# Altium project GPSDO.PrjPCB (part 1 of 4)
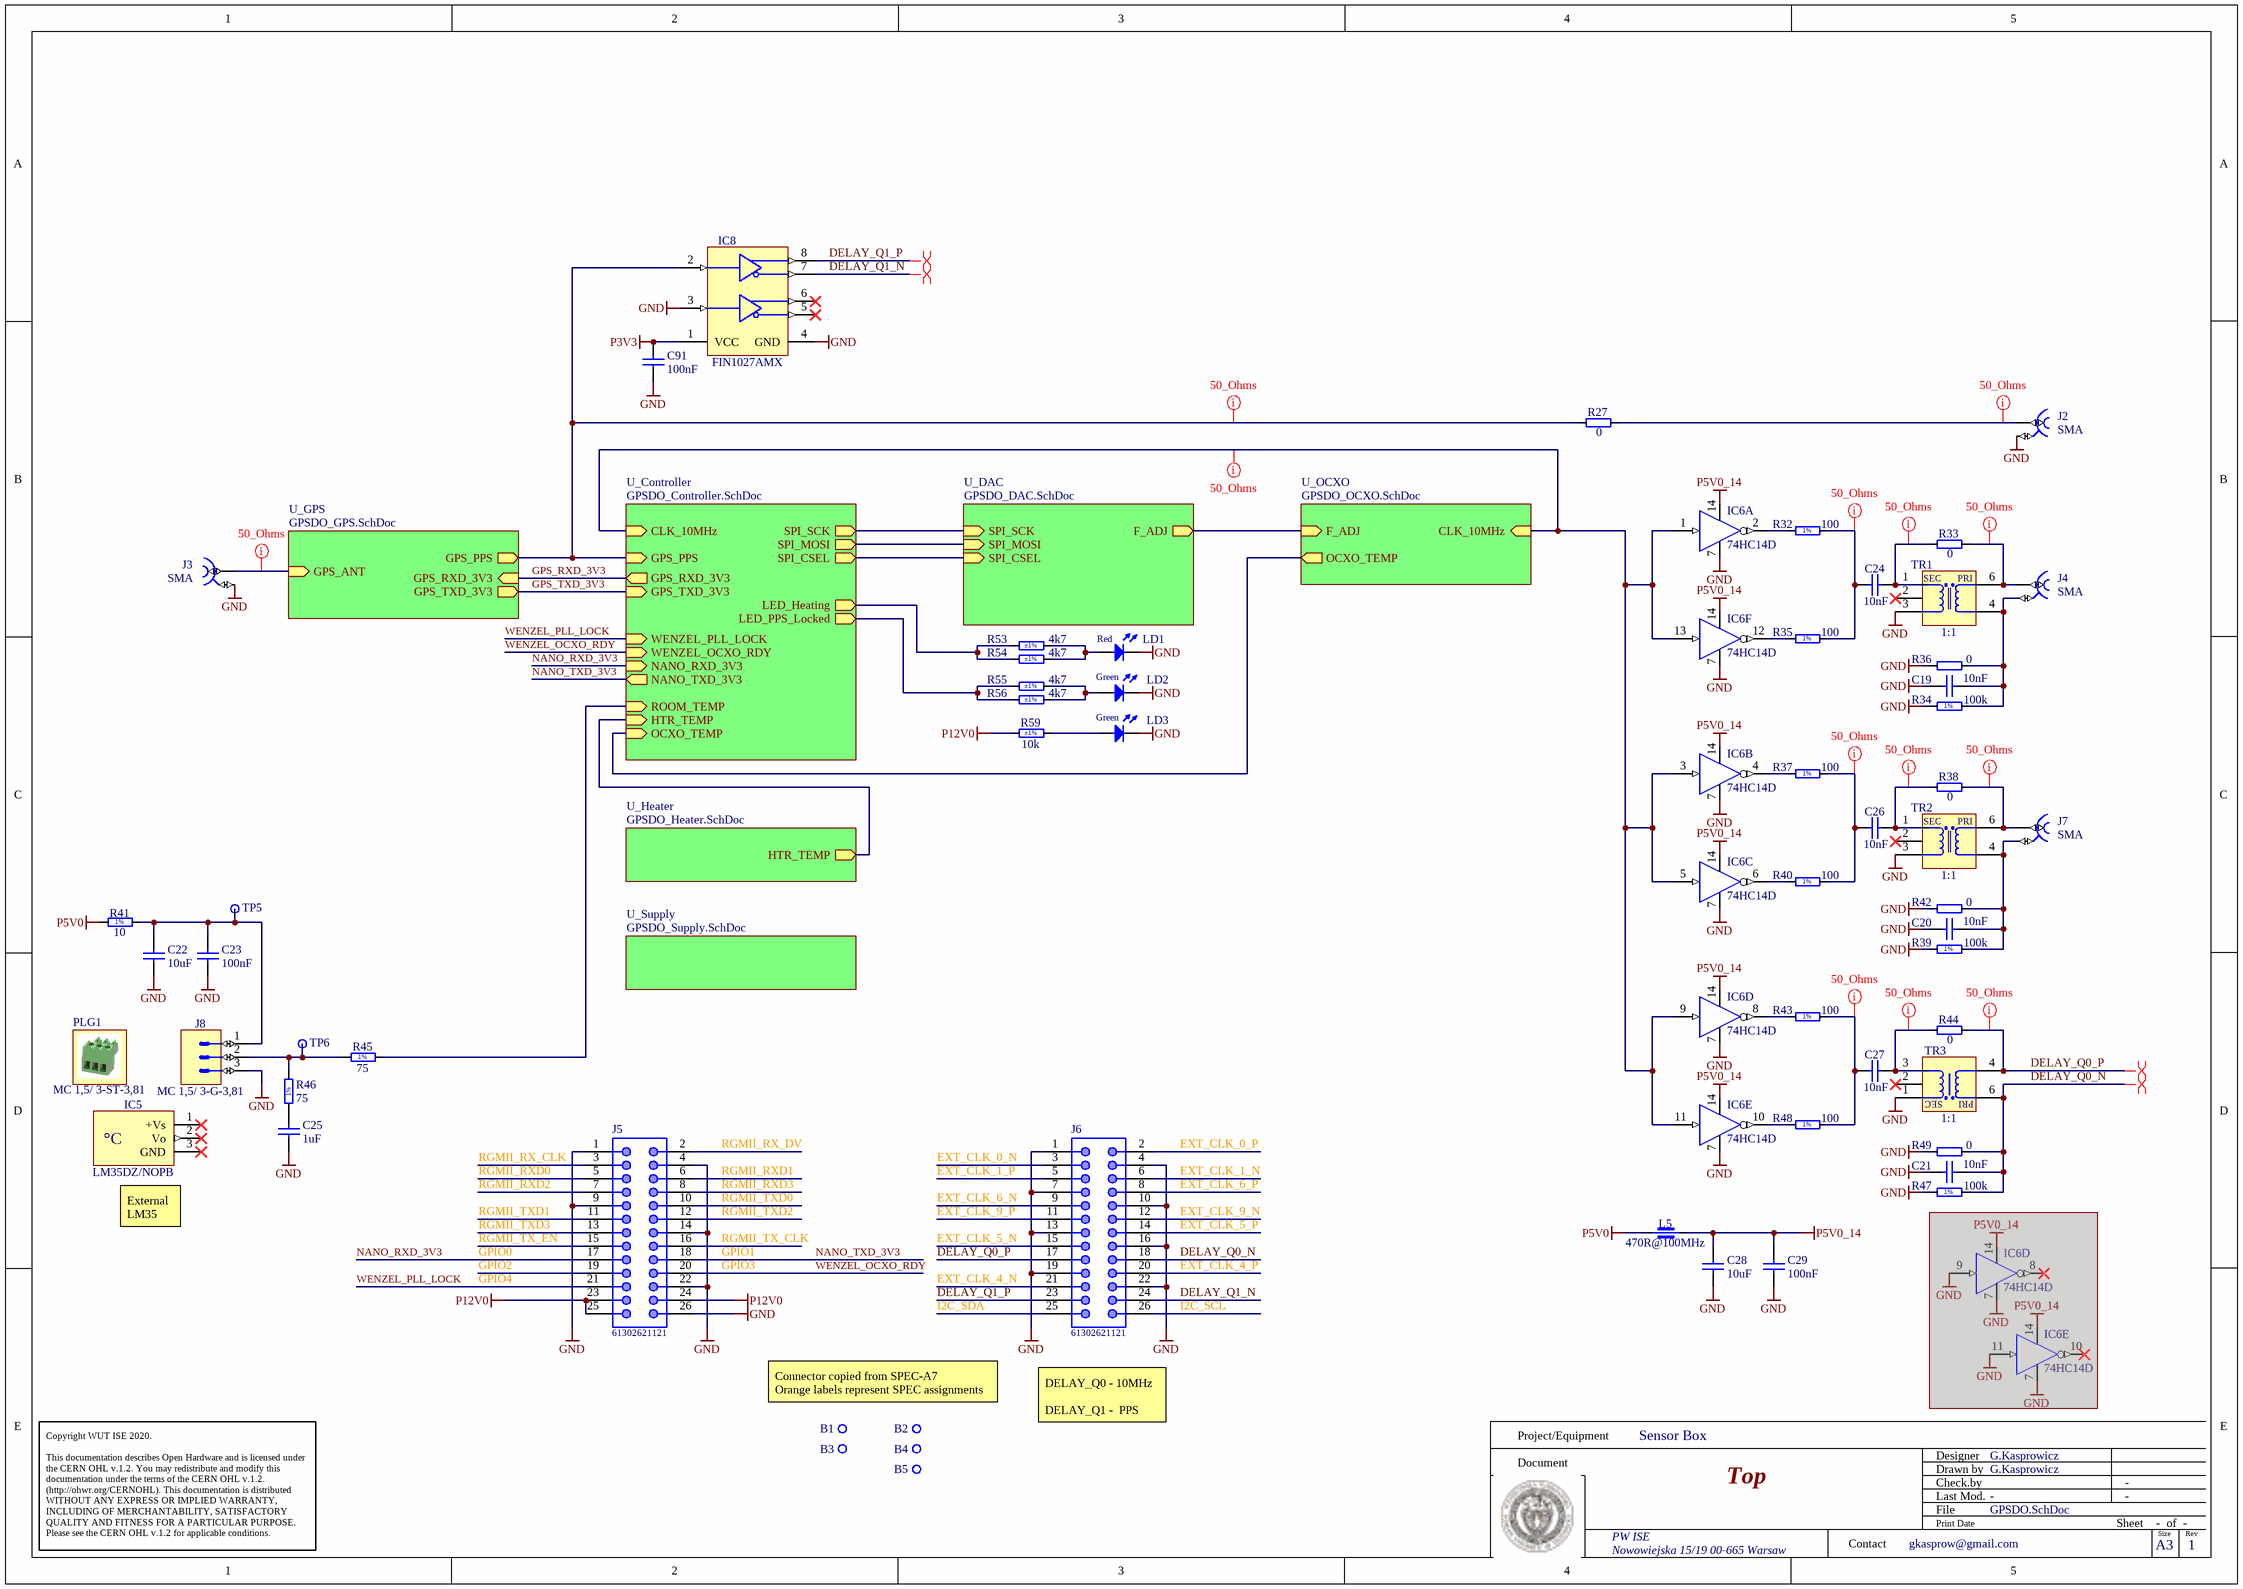
[diagram p0: GPSDO.SchDoc]
8 sheets, 359 parts. Net scope: hierarchical (ports join the sheet entries above them; power ports are global).
Board file: GSPDO.PcbDoc
Sheets:
  GPSDO.SchDoc
    U_Heater = GPSDO_Heater.SchDoc
    U_Controller = GPSDO_Controller.SchDoc
      Arduino = GPSDO_Arduino.SchDoc
    U_Supply = GPSDO_Supply.SchDoc
    U_GPS = GPSDO_GPS.SchDoc
    U_DAC = GPSDO_DAC.SchDoc
    U_OCXO = GPSDO_OCXO.SchDoc

## Sheet GPSDO.SchDoc: Top
size 420 x 297 mm; EDA_Number: ARTIQ; Projet: GPSDO; Author: G.Kasprowicz; CompanyName: WUT ISE; DrawnBy: G.Kasprowicz; Organization: WUT ISE; Address1: PW ISE; Address2: Nowowiejska 15/19 00-665 Warsaw; Address3: gkasprow@gmail.com; Revision: 1; SheetNumber: -; SheetTotal: -; ModifiedBy: -; CheckedDate: -; DivGrp: WUT ISE; Designer: G.Kasprowicz; ModifiedDate: -; ProjectName: Sensor Box

### Parts
(Parts that share a designator on the sheet are numbered #1, #2 ... from top to bottom, then left to right.)
B1  Plated Hole  [MTG270_500]  (value not drawn)  (no BOM)
B2  Non Plated Hole  [MTG400]  (value not drawn)  (no BOM)
B3  Plated Hole  [MTG270_500]  (value not drawn)  (no BOM)
B4  Non Plated Hole  [MTG400]  (value not drawn)  (no BOM)
B5  Non Plated Hole  [MTG400]  (value not drawn)  (no BOM)
C19  10nF  [CAPC1005X55N]
C20  10nF  [CAPC1005X55N]
C21  10nF  [CAPC1005X55N]
C22  10uF  [CAPC1608X80N]
C23  100nF  [CAPC1005X55N]
C24  10nF  [CAPC1005X55N]
C25  1uF  [CAPC1005X55N]
C26  10nF  [CAPC1005X55N]
C27  10nF  [CAPC1005X55N]
C28  10uF  [CAPC1608X80N]
C29  100nF  [CAPC1005X55N]
C91  100nF  [CAPC1005X55N]
IC5  LM35DZ/NOPB  [TO-92AA-P254]  (mechanical)
IC6#1  74HC14D  [SOIC127P600X175-14N]  (parts A,B,C,D,E,F of 6)
IC6#2  74HC14D  [SOIC127P600X175-14N]  (parts D,E of 6)  (masked out: inside a compile mask, not in the netlist)
IC8  FIN1027AMX  [SOIC127P600X175-8N]
J2  SMA  [DELOCK_65848]
J3  SMA  [DELOCK_65848]
J4  SMA  [DELOCK_65848]
J5  61302621121  [61302621121]
J6  61302621121  [61302621121]
J7  SMA  [DELOCK_65848]
J8  MC 1,5/ 3-G-3,81  [PHOENIX_1803280]
L5  470R@100MHz  [INDC1608X95N]
LD1  Red  [LED_AVAGO_HSMC-C120]
LD2  Green  [LED_AVAGO_HSME-C120]
LD3  Green  [LED_AVAGO_HSME-C120]
PLG1  MC 1,5/ 3-ST-3,81  [PHOENIX_1803581]
R27  0  [RESC1005X40N]
R32  100  [RESC1005X40N]
R33  0  [RESC1005X40N]
R34  100k  [RESC1005X40N]
R35  100  [RESC1005X40N]
R36  0  [RESC1608X55N]
R37  100  [RESC1005X40N]
R38  0  [RESC1005X40N]
R39  100k  [RESC1005X40N]
R40  100  [RESC1005X40N]
R41  10  [RESC1005X40N]
R42  0  [RESC1608X55N]
R43  100  [RESC1005X40N]
R44  0  [RESC1005X40N]
R45  75  [RESC1005X40N]
R46  75  [RESC1005X40N]
R47  100k  [RESC1005X40N]
R48  100  [RESC1005X40N]
R49  0  [RESC1608X55N]
R53  4k7  Tolerance: ±1%  [RESC1005X40N]
R54  4k7  Tolerance: ±1%  [RESC1005X40N]
R55  4k7  Tolerance: ±1%  [RESC1005X40N]
R56  4k7  Tolerance: ±1%  [RESC1005X40N]
R59  10k  Tolerance: ±1%  [RESC1005X40N]
TP5  Test Point  [TPS127]  (value not drawn)  (no BOM)
TP6  Test Point  [TPS127]  (value not drawn)  (no BOM)
TR1  1:1  [XFMR_MINI-CIRCUITS_AT224-1]
TR2  1:1  [XFMR_MINI-CIRCUITS_AT224-1]
TR3  1:1  [XFMR_MINI-CIRCUITS_AT224-1]

### Sub-sheets
U_Controller = GPSDO_Controller.SchDoc: GPS_RXD_3V3 (out), GPS_TXD_3V3 (in), GPS_PPS (in), ROOM_TEMP (in), CLK_10MHz (in), OCXO_TEMP (in), HTR_TEMP (in), SPI_SCK (out), SPI_MOSI (out), SPI_CSEL (out), NANO_RXD_3V3 (in), NANO_TXD_3V3 (out), LED_Heating (out), LED_PPS_Locked (out), WENZEL_PLL_LOCK (in), WENZEL_OCXO_RDY (in)
U_DAC = GPSDO_DAC.SchDoc: F_ADJ (out), SPI_SCK (in), SPI_MOSI (in), SPI_CSEL (in)
U_GPS = GPSDO_GPS.SchDoc: GPS_RXD_3V3 (in), GPS_TXD_3V3 (out), GPS_PPS (out), GPS_ANT (in)
U_Heater = GPSDO_Heater.SchDoc: HTR_TEMP (out)
U_OCXO = GPSDO_OCXO.SchDoc: CLK_10MHz (in), OCXO_TEMP (out), F_ADJ (in)
U_Supply = GPSDO_Supply.SchDoc: no entries

### Nets
GND: C19.1 C20.1 C21.1 C22.1 C23.1 C25.1 C28.1 C29.1 C91.1 IC6#1.7(GND) IC8.3(DIN2RIN-) IC8.4(GND) J2.2 J3.2 J5.1 J5.4 J5.9 J5.14 J5.22 J5.26 J6.1 J6.4 J6.7 J6.10 J6.13 J6.16 J6.19 J6.22 J8.3 LD1.1(C) LD2.1(C) LD3.1(C) R34.2 R36.1 R39.2 R42.1 R47.2 R49.1 TR1.3(S) TR2.3(S) TR3.1(SDOT)
P3V3: C91.2 IC8.1(VCC)
P5V0: L5.1 R41.1
P5V0_14: C28.2 C29.2 IC6#1.14(VCC) L5.2
P12V0: J5.23 J5.24 J5.25 R59.1
10MHz: IC6#1.1(IN) IC6#1.3(IN) IC6#1.5(IN) IC6#1.9(IN) IC6#1.11(IN) IC6#1.13(IN) ; sheet U_Controller/CLK_10MHz, sheet U_OCXO/CLK_10MHz
A1: sheet U_Heater/HTR_TEMP, sheet U_Controller/HTR_TEMP
A2: sheet U_Controller/OCXO_TEMP, sheet U_OCXO/OCXO_TEMP
A3: R45.2 ; sheet U_Controller/ROOM_TEMP
D2: R53.1 R54.1 ; sheet U_Controller/LED_Heating
D7: sheet U_Controller/SPI_SCK, sheet U_DAC/SPI_SCK
D9: sheet U_Controller/SPI_MOSI, sheet U_DAC/SPI_MOSI
D11: sheet U_Controller/SPI_CSEL, sheet U_DAC/SPI_CSEL
D13: R55.1 R56.1 ; sheet U_Controller/LED_PPS_Locked
DELAY_Q0_N: C21.2 J6.18 R47.1 R49.2 TR3.6(PDOT)
DELAY_Q0_P: J6.17 R44.1 TR3.4(P)
DELAY_Q1_N: IC8.7(DOUT-) J6.24
DELAY_Q1_P: IC8.8(DOUT+) J6.23
F_ADJ: sheet U_DAC/F_ADJ, sheet U_OCXO/F_ADJ
GPS_ANT: J3.1 ; sheet U_GPS/GPS_ANT
GPS_RXD_3V3: sheet U_Controller/GPS_RXD_3V3, sheet U_GPS/GPS_RXD_3V3
GPS_TXD_3V3: sheet U_Controller/GPS_TXD_3V3, sheet U_GPS/GPS_TXD_3V3
NANO_RXD_3V3: J5.17 ; sheet U_Controller/NANO_RXD_3V3
NANO_TXD_3V3: J5.18 ; sheet U_Controller/NANO_TXD_3V3
PPS: IC8.2(DIN1) R27.2 ; sheet U_Controller/GPS_PPS, sheet U_GPS/GPS_PPS
WENZEL_OCXO_RDY: J5.20 ; sheet U_Controller/WENZEL_OCXO_RDY  [project net D14]
WENZEL_PLL_LOCK: J5.21 ; sheet U_Controller/WENZEL_PLL_LOCK  [project net D15]
NetC19_2: C19.2 J4.2 R34.1 R36.2 TR1.4(P)
NetC20_2: C20.2 J7.2 R39.1 R42.2 TR2.4(P)
NetC22_2: C22.2 C23.2 J8.1 R41.2 TP5.1
NetC24_1: C24.1 R32.2 R35.2
NetC24_2: C24.2 R33.2 TR1.1(SDOT)
NetC25_2: C25.2 R46.1
NetC26_1: C26.1 R37.2 R40.2
NetC26_2: C26.2 R38.2 TR2.1(SDOT)
NetC27_1: C27.1 R43.2 R48.2
NetC27_2: C27.2 R44.2 TR3.3(S)
NetIC6#1_2: IC6#1.2(OUT) R32.1
NetIC6#1_4: IC6#1.4(OUT) R37.1
NetIC6#1_6: IC6#1.6(OUT) R40.1
NetIC6#1_8: IC6#1.8(OUT) R43.1
NetIC6#1_10: IC6#1.10(OUT) R48.1
NetIC6#1_12: IC6#1.12(OUT) R35.1
NetJ2_1: J2.1 R27.1
NetJ4_1: J4.1 R33.1 TR1.6(PDOT)
NetJ7_1: J7.1 R38.1 TR2.6(PDOT)
NetJ8_2: J8.2 R45.1 R46.2 TP6.1
NetLD1_2: LD1.2(A) R53.2 R54.2
NetLD2_2: LD2.2(A) R55.2 R56.2
NetLD3_2: LD3.2(A) R59.2

Not connected (* = marked no-connect by the designer): B1 1; B2 1; B3 1; B4 1; B5 1; IC5 1(+Vs)* 2(Vo)* 3(GND)*; IC8 5(DOUT-)* 6(DOUT+)*; J5 2 3 5 6 7 8 10 11 12 13 15 16 19; J6 2 3 5 6 8 9 11 12 14 15 20 21 25 26; TR1 2(NU)*; TR2 2(NU)*; TR3 2(NU)*

### Layout directives
net class 50_Ohms: 10MHz, DELAY_Q0_P, GPS_ANT, NetC24_1, NetC24_2, NetC26_1, NetC26_2, NetC27_1, NetC27_2, NetJ2_1, NetJ4_1, NetJ7_1, PPS
differential pair: DELAY_Q0_N, DELAY_Q0_P, DELAY_Q1_N, DELAY_Q1_P

### Notes on the sheet
- RGMII_RX_CLK
- RGMII_RXD0
- RGMII_RXD2
- RGMII_RX_DV
- RGMII_RXD1
- RGMII_RXD3
- RGMII_TXD0
- EXT_CLK_0_N
- EXT_CLK_1_P
- EXT_CLK_6_N
- (near J6) EXT_CLK_0_P
- (near J6) EXT_CLK_6_P
- (near J6) EXT_CLK_1_N
- (near IC5) External LM35
- RGMII_TXD1
- RGMII_TXD3
- RGMII_TX_EN
- GPIO0
- GPIO2
- RGMII_TXD2
- RGMII_TX_CLK
- GPIO1
- GPIO3
- EXT_CLK_9_P
- EXT_CLK_5_N
- (near J6) EXT_CLK_9_N
- (near J6) EXT_CLK_5_P
- (near J6) EXT_CLK_4_P
- GPIO4
- EXT_CLK_4_N
- I2C_SDA
- (near J6) I2C_SCL
- Connector copied from SPEC-A7
  Orange labels represent SPEC assignments
- DELAY_Q0 - 10MHz
  DELAY_Q1 -  PPS
- Project/Equipment
- Document
- Designer
- Drawn by
- Check.by
- Copyright WUT ISE 2020.
  This documentation describes Open Hardware and is licensed under the CERN OHL v.1.2. You may redistribute and modify this documentation under the terms of the CERN OHL v.1.2. (http://ohwr.org/CERNOHL). This documentation is distributed WITHOUT ANY EXPRESS OR IMPLIED WARRANTY, INCLUDING OF MERCHANTABILITY, SATISFACTORY QUALITY AND FITNESS FOR A PARTICULAR PURPOSE. Please see the CERN OHL v.1.2 for applicable conditions.
- Contact
- File
- Last Mod.
- Print Date
- Sheet
- Size
- A3
- of
- Rev
- (in symbol LM35DZ/NOPB) °C
- (in symbol R0402_10R_1%_0.0625W_200PPM) 1%
- (in symbol R0402_75R_1%_0.0625W_100PPM) 1%
- (in symbol R0402_100K_1%_0.0625W_100PPM) 1%
- (in symbol R0402_100R_1%_0.0625W_100PPM) 1%
- (in symbol XFMR_MINI-CIRCUITS_TC1-1+) SEC; PRI

### Library data of the parts
B1 B3 = PLATED_HOLE2.7_PAD5.0: Single Terminal Socket; Part Description: Plated Through Hole: Hole Dia.=2.7mm Pad Dia.=5.0mm; Mounted: No; Part Number: PLATED_HOLE2.7_PAD5.0; Component Type: Standard (No BOM); Pin Count: 1; Family: Plated Hole; Socket: No; SMD: No; Sense: No; Status: None; ComponentHeight: 0mm; HelpURL: Undefined; Author: CERN DEM JMW; CreateDate: 27.09.2011; LatestRevisionDate: 27.09.2011; PackageDescription: Plated Through Hole: Hole Dia.=2.7mm Pad Dia.=5.0mm
B2 B4 B5 = NON-PLATED_HOLE4.0: Single Terminal Socket; Part Description: Non Plated Through Hole: Hole Dia.=4.0mm; Mounted: No; Part Number: NON-PLATED_HOLE4.0; Component Type: Standard (No BOM); Pin Count: 1; Family: Non Plated Hole; Socket: No; SMD: No; Sense: No; Status: None; ComponentHeight: 0mm; HelpURL: Undefined; Author: CERN DEM JMW; CreateDate: 22.03.2019; LatestRevisionDate: 22.03.2019; PackageDescription: Non Plated Through Hole: Hole Dia.=4.0mm
C19-C21 C24 C26 C27 = CC0402_10NF_16V_10%_X7R: Non-polarised capacitor; Part Description: SMD Multilayer Chip Ceramic Capacitor; Manufacturer: GENERIC; Manufacturer1 Part Number: 223878715636; Voltage: 16V; TC: X7R; Tolerance: ±10%; Part Number: CC0402_10NF_16V_10%_X7R; Component Kind: Standard; Component Type: Standard; Pin Count: 2; Value: 10nF; Status: Not Recommended; Manufacturer Part Number: CC0402_10NF_16V_10%_X7R; Case: 0402; Mounted: Yes; Socket: No; SMD: Yes; Sense: No; Manufacturer1 Example: PHYCOMP; Manufacturer1 ComponentHeight: 0.55mm; HelpURL: \\cern.ch\dfs\Applications\Altium\Datasheets\CC0402_X7R_PHYCOMP.pdf; Author: CERN DEM JLC; CreateDate: 2007-12-03; LatestRevisionDate: 2007-12-03
C22 C28 = CC0603_10UF_10V_10%_X5R: Non-polarised capacitor; Part Description: SMD Multilayer Chip Ceramic Capacitor; Manufacturer: GENERIC; Manufacturer1 Part Number: GRM188R61A106KE69D; Voltage: 10V; TC: X5R; Tolerance: ±10%; Part Number: CC0603_10UF_10V_10%_X5R; Component Kind: Standard; Component Type: Standard; Pin Count: 2; Value: 10uF; Status: None; Manufacturer Part Number: CC0603_10UF_10V_10%_X5R; Case: 0603; Mounted: Yes; Socket: No; SMD: Yes; Sense: No; Manufacturer1 Example: MURATA; Manufacturer1 ComponentHeight: 0.8mm; HelpURL: \\cern.ch\dfs\Applications\Altium\Datasheets\CC0603_MURATA_GRM188R61A106KE69D.pdf; Author: CERN DEM JLC; CreateDate: 31.01.2017; LatestRevisionDate: 31.01.2017
C23 C29 C91 = CC0402_100NF_16V_10%_X5R: Non-polarised capacitor; Part Description: SMD Multilayer Chip Ceramic Capacitor; Manufacturer: GENERIC; Manufacturer1 Part Number: GRM155R61C104KA88D; Voltage: 16V; TC: X5R; Tolerance: ±10%; Part Number: CC0402_100NF_16V_10%_X5R; Component Kind: Standard; Component Type: Standard; Pin Count: 2; Value: 100nF; Status: None; Manufacturer Part Number: CC0402_100NF_16V_10%_X5R; Case: 0402; Mounted: Yes; Socket: No; SMD: Yes; Sense: No; Manufacturer1 Example: MURATA; Manufacturer1 ComponentHeight: 0.55mm; HelpURL: \\cern.ch\dfs\Applications\Altium\Datasheets\CC0402_X5R_MURATA_GRM.pdf; Author: CERN DEM JLC; CreateDate: 10.12.2013; LatestRevisionDate: 10.12.2013
C25 = CC0402_1UF_16V_10%_X5R: Non-polarised capacitor; Part Description: SMD Multilayer Chip Ceramic Capacitor; Manufacturer: GENERIC; Manufacturer1 Part Number: C1005X5R1C105KT; Voltage: 16V; TC: X5R; Tolerance: ±10%; Part Number: CC0402_1UF_16V_10%_X5R; Component Kind: Standard; Component Type: Standard; Pin Count: 2; Value: 1uF; Status: Preferred; Manufacturer Part Number: CC0402_1UF_16V_10%_X5R; Case: 0402; Mounted: Yes; Socket: No; SMD: Yes; Sense: No; Manufacturer1 Example: TDK; Manufacturer1 ComponentHeight: 0.55mm; HelpURL: \\cern.ch\dfs\Applications\Altium\Datasheets\CC0402_X5R_TDK_C.pdf; Author: CERN DEM JLC; CreateDate: 25.10.2012; LatestRevisionDate: 25.10.2012
IC5 = LM35DZ/NOPB: Precision Centigrade Temperature Sensor; Part Description: 0° to +100°C ±0.6°C Precision Centigrade Temperature Sensor; Manufacturer: TEXAS INSTRUMENTS; PressFit: No; Bonding: No; Part Number: LM35DZ/NOPB; Component Type: Standard; Device: LM35DZ/NOPB; PackageDescription: TO-92 (TO226), Pitch 1.27mm, Flat Index, 3 In-Line, Bent Leads, Body Dia. 5.3mm; Manufacturer Part Number: LM35DZ/NOPB; Pin Count: 3; Case: TO-92; Mounted: Yes; Socket: No; SMD: No; Sense: No; ComponentHeight: 9.34mm; HelpURL: \\cern.ch\dfs\Applications\Altium\Datasheets\LM35DZ-NOPB.pdf; Author: CERN DEM JMW; CreateDate: 16/07/2012; LatestRevisionDate: 16/07/2012
IC6#1 IC6#2 = 74HC14D: Hex Schmitt-Trigger Inverter; Part Description: Hex  Inverterting Schmitt-Trigger; Manufacturer: NXP SEMICONDUCTORS; PressFit: No; Bonding: No; Part Number: 74HC14D; Component Kind: Standard; Component Type: Standard; Device: 74HC14D; PackageDescription: SOIC 14, Pitch 1.27mm - Body 4x8.75mm, IPC Medium Density; Manufacturer Part Number: 74HC14D; Pin Count: 14; Case: SOIC14; Mounted: Yes; Socket: No; SMD: Yes; Sense: No; ComponentHeight: 1.75mm; Author: CERN DEM JLC; HelpURL: \\cern.ch\dfs\Applications\Altium\Datasheets\74HC14D.pdf; CreateDate: 26/08/2014; LatestRevisionDate: 26/08/2014
IC8 = IFC_FIN1027A: 3.3V LVDS, 2-Bit, High-Speed, Differential Driver; Manufacturer: ON Semiconductor; PressFit: No; Bonding: No; Part Number: FIN1027AMX; Component Kind: Standard; Component Type: Standard; Device: FIN1027AMX; PackageDescription: SOIC 8, Pitch 1.27mm - Body 4x5mm, IPC Medium Density; Part Description: 3.3V LVDS, 2-Bit, High-Speed, Differential Driver; Manufacturer Part Number: FIN1027AMX; Pin Count: 8; Case: SOIC8; Mounted: Yes; Socket: No; SMD: Yes; Sense: No; ComponentHeight: 0.8mm; Author: GK; HelpURL: \\cern.ch\dfs\Applications\Altium\Datasheets\FIN1101K8X.pdf; CreateDate: 08/11/2016; LatestRevisionDate: 08/11/2016
J2-J4 J7 = DELOCK_65848: 50 Ohm Through Hole SMA Right Angle PCB Jack; Manufacturer: DELOCK; Manufacturer Part Number: 5848 (4043619658480); PressFit: No; Part Number: DELOCK_65848; Component Kind: Standard; Component Type: Standard; Pin Count: 5; Family: SMA; Mounted: Yes; Socket: No; SMD: No; Sense: No; Status: None; Part Description: 50 Ohm Through Hole SMA Right Angle PCB Jack; ComponentHeight: 12.5; HelpURL: \\cern.ch\dfs\Applications\Altium\Datasheets\AMPHENOL_132203-16.pdf; Author: GK; CreateDate: 13.05.2019; LatestRevisionDate: 13.05.2019
J5 J6 = 61302621121: WR-PHD Pin Header, THT, pitch 2.54mm, Dual Row, Vertical, 26pin; Pin Number: 26; Gender: Male; Rated Current: 3A; Working Voltage: 250VAC; Withstanding Voltage: 500VAC; Contact Resistance: 20mOhm; ComponentLink1Description: Manufacturer; ComponentLink1URL: http://www.we-online.de; ComponentLink2Description: Datasheet; ComponentLink2URL: https://katalog.we-online.de/em/datasheet/6130xx21121.pdf; Part Number: 61302621121; Published Date: June 2019; Publisher: Wurth Elektronik; Pitch: 2.54mm; Operating Temperature: -40 to +105degC; Mounting Technology: THT; Packaging: Bag; Row Number: Dual; Orientation: Vertical
J8 = PHOENIX_1803280: Connector 3 Male; Part Description: 8A 160 V, Pitch: 3.81mm, 3 Positions  Right Angled Header; Manufacturer: PHOENIX CONTACT; Manufacturer Part Number: 1803277 (MC 1,5/ 3-G-3,81); PressFit: No; Part Number: PHOENIX_1803280; Component Kind: Standard; Component Type: Standard; Pin Count: 3; Mounted: Yes; Socket: No; SMD: No; Sense: No; Status: None; ComponentHeight: 7.25mm; HelpURL: \\cern.ch\dfs\Applications\Altium\Datasheets\PHOENIX_1803280.pdf; Author: CERN DEM BC; CreateDate: 23/09/2019; LatestRevisionDate: 23/09/2019; Family: MC 1,5/ 3-G-3,81
L5 = IND0603_MURATA_BLM18PG471SN1D: Part Description: SMD EMIFIL Chip Ferrite Bead; Manufacturer: MURATA; Power: 1A; Resistance: 0.2R; Tolerance: ±25%; Part Number: IND0603_MURATA_BLM18PG471SN1D; Component Kind: Standard; Component Type: Standard; Pin Count: 2; Value: 470R@100MHz; Manufacturer Part Number: BLM18PG471SN1D; Case: 0603; Mounted: Yes; Socket: No; SMD: Yes; Sense: No; ComponentHeight: 0.95mm; HelpURL: \\cern.ch\dfs\Applications\Altium\Datasheets\IND0603_MURATA_BLM18P.pdf; Author: CERN DEM BC; CreateDate: 17.02.2021; LatestRevisionDate: 17.02.2021
LD1 = LED_AVAGO_HSMC-C120: LED Red 1C 2A; Part Description: High Performance Right Angle Chip Red LED; Manufacturer: AVAGO TECHNOLOGIES; PressFit: No; Bonding: No; Part Number: LED_AVAGO_HSMC-C120; Component Kind: Standard; Component Type: Standard; Color: Red; PackageDescription: Red Chip LED, 2-Leads, Body 1.7x1.1mm, Side Emitting Package; Manufacturer Part Number: HSMC-C120; Pin Count: 2; Mounted: Yes; Socket: No; SMD: Yes; Sense: No; ComponentHeight: 0.7mm; HelpURL: \\cern.ch\dfs\Applications\Altium\Datasheets\LED_AVAGO_HSMC-C120.pdf; ComponentLink1URL: \\cern.ch\dfs\Applications\Altium\Datasheets\LED_AVAGO_HSMC-C120_DESIGN-GUIDE.pdf; ComponentLink1Description: Design Guide; Author: CERN DEM JMW; CreateDate: 22.07.2009; LatestRevisionDate: 20.06.2012
LD2 LD3 = LED_AVAGO_HSME-C120: LED Green 1C 2A; Part Description: High Performance Right Angle Chip Green LED; Manufacturer: AVAGO TECHNOLOGIES; PressFit: No; Bonding: No; Part Number: LED_AVAGO_HSME-C120; Component Kind: Standard; Component Type: Standard; Color: Green; PackageDescription: Green Chip LED, 2-Leads, Body 1.7x1.1mm, Side Emitting Package; Manufacturer Part Number: HSME-C120; Pin Count: 2; Mounted: Yes; Socket: No; SMD: Yes; Sense: No; ComponentHeight: 0.7mm; HelpURL: \\cern.ch\dfs\Applications\Altium\Datasheets\LED_AVAGO_HSME-C120.pdf; ComponentLink1URL: \\cern.ch\dfs\Applications\Altium\Datasheets\LED_AVAGO_HSME-C110_DESIGN-GUIDE.pdf; ComponentLink1Description: Design Guide; Author: CERN DEM JMW; CreateDate: 22.07.2009; LatestRevisionDate: 20.06.2012
PLG1 = Phoenix_1803581: Part Number: 1803581; Manufacturer Part Number: 1803581; Manufacturer: Phoenix; Device: MC 1,5/ 3-ST-3,81
R27 R33 R38 R44 = R0402_0R_JUMPER: Resistor; Part Description: 1A (0.05R Max DC Resistance) Zero Ohm Jumper; Manufacturer: GENERIC; Manufacturer1 Part Number: 232270591001L; Part Number: R0402_0R_JUMPER; Component Kind: Standard; Component Type: Standard; Pin Count: 2; Value: 0; Status: Not recommended; Manufacturer Part Number: R0402_0R_JUMPER; Case: 0402; Mounted: Yes; Sense: No; Socket: No; SMD: Yes; Manufacturer1 Example: YAGEO PHYCOMP; Manufacturer1 ComponentHeight: 0.4mm; HelpURL: \\cern.ch\dfs\Applications\Altium\Datasheets\R0402_Phycomp_RC0402.pdf; Author: CERN DEM JLC; CreateDate: 2007-12-03; LatestRevisionDate: 2012-10-17
R32 R35 R37 R40 R43 R48 = R0402_100R_1%_0.0625W_100PPM: Resistor - 1%; Part Description: General Purpose Thick Film Chip Resistor; Manufacturer: GENERIC; Manufacturer1 Part Number: 232270671001L; TC: ±100ppm/°C; PressFit: No; Part Number: R0402_100R_1%_0.0625W_100PPM; Component Kind: Standard; Component Type: Standard; Pin Count: 2; Value: 100; Status: Not Recommended; Power: 0.0625W; Tolerance: ±1%; Manufacturer Part Number: R0402_100R_1%_0.0625W_100PPM; Case: 0402; Mounted: Yes; Sense: No; Socket: No; SMD: Yes; Manufacturer1 Example: YAGEO PHYCOMP; Manufacturer1 ComponentHeight: 0.4mm; HelpURL: \\cern.ch\dfs\Applications\Altium\Datasheets\R0402_Phycomp_RC0402.pdf; Author: CERN DEM JLC; CreateDate: 03.12.2007; LatestRevisionDate: 17.10.2012
R34 R39 R47 = R0402_100K_1%_0.0625W_100PPM: Resistor - 1%; Part Description: General Purpose Thick Film Chip Resistor; Manufacturer: GENERIC; Manufacturer1 Part Number: 232270671004L; PressFit: No; TC: ±100ppm/°C; Part Number: R0402_100K_1%_0.0625W_100PPM; Component Kind: Standard; Component Type: Standard; Pin Count: 2; Value: 100k; Status: Not Recommended; Manufacturer Part Number: R0402_100K_1%_0.0625W_100PPM; Case: 0402; Mounted: Yes; Sense: No; Socket: No; SMD: Yes; Manufacturer1 Example: YAGEO PHYCOMP; Manufacturer1 ComponentHeight: 0.4mm; HelpURL: \\cern.ch\dfs\Applications\Altium\Datasheets\R0402_Phycomp_RC0402.pdf; Author: CERN DEM JLC; CreateDate: 03.12.2007; LatestRevisionDate: 17.10.2012; Power: 0.0625W; Tolerance: ±1%
R36 R42 R49 = R0603_0R_JUMPER: Resistor; Part Description: 1A (0.05R Max DC Resistance) Zero Ohm Jumper; Manufacturer: GENERIC; Manufacturer1 Part Number: NRC06Z0; PressFit: No; Part Number: R0603_0R_JUMPER; Component Kind: Standard; Component Type: Standard; Pin Count: 2; Value: 0; Status: Preferred; Manufacturer Part Number: R0603_0R_JUMPER; Case: 0603; Mounted: Yes; Sense: No; Socket: No; SMD: Yes; Manufacturer1 Example: NIC COMPONENT; Manufacturer1 ComponentHeight: 0.55mm; HelpURL: \\cern.ch\dfs\Applications\Altium\Datasheets\R0603_NIC_NRC.pdf; Author: CERN DEM JLC; CreateDate: 03.12.2007; LatestRevisionDate: 13.03.2008
R41 = R0402_10R_1%_0.0625W_200PPM: Resistor - 1%; Part Description: General Purpose Thick Film Chip Resistor; Manufacturer: GENERIC; Manufacturer1 Part Number: 232270671009L; TC: ±200ppm/°C; PressFit: No; Part Number: R0402_10R_1%_0.0625W_200PPM; Component Kind: Standard; Component Type: Standard; Pin Count: 2; Value: 10; Status: Not Recommended; Power: 0.0625W; Tolerance: ±1%; Manufacturer Part Number: R0402_10R_1%_0.0625W_200PPM; Case: 0402; Mounted: Yes; Sense: No; Socket: No; SMD: Yes; Manufacturer1 Example: YAGEO PHYCOMP; Manufacturer1 ComponentHeight: 0.4mm; HelpURL: \\cern.ch\dfs\Applications\Altium\Datasheets\R0402_Phycomp_RC0402.pdf; Author: CERN DEM JLC; CreateDate: 24/06/2009; LatestRevisionDate: 17/10/2012
R45 R46 = R0402_75R_1%_0.0625W_100PPM: Resistor - 1%; Part Description: General Purpose Thick Film Chip Resistor; Manufacturer: GENERIC; Manufacturer1 Part Number: 232270677509L; TC: ±100ppm/°C; PressFit: No; Part Number: R0402_75R_1%_0.0625W_100PPM; Component Kind: Standard; Component Type: Standard; Pin Count: 2; Value: 75; Status: Not Recommended; Power: 0.0625W; Tolerance: ±1%; Manufacturer Part Number: R0402_75R_1%_0.0625W_100PPM; Case: 0402; Mounted: Yes; Sense: No; Socket: No; SMD: Yes; Manufacturer1 Example: YAGEO PHYCOMP; Manufacturer1 ComponentHeight: 0.4mm; HelpURL: \\cern.ch\dfs\Applications\Altium\Datasheets\R0402_Phycomp_RC0402.pdf; Author: CERN DEM JLC; CreateDate: 03/12/2007; LatestRevisionDate: 17/10/2012
R53-R56 = R0402_4K7_1%_0.0625W_100PPM: Resistor - 1%; Part Description: General Purpose Thick Film Chip Resistor; Manufacturer: GENERIC; Manufacturer1 Part Number: 232270674702L; TC: ±100ppm/°C; PressFit: No; Part Number: R0402_4K7_1%_0.0625W_100PPM; Component Kind: Standard; Component Type: Standard; Pin Count: 2; Value: 4k7; Status: Not Recommended; Power: 0.0625W; Manufacturer Part Number: R0402_4K7_1%_0.0625W_100PPM; Case: 0402; Mounted: Yes; Sense: No; Socket: No; SMD: Yes; Manufacturer1 Example: YAGEO PHYCOMP; Manufacturer1 ComponentHeight: 0.4mm; HelpURL: \\cern.ch\dfs\Applications\Altium\Datasheets\R0402_Phycomp_RC0402.pdf; Author: CERN DEM JLC; CreateDate: 03.12.2007; LatestRevisionDate: 17.10.2012
R59 = R0402_10K_1%_0.0625W_100PPM: Resistor - 1%; Part Description: General Purpose Thick Film Chip Resistor; Manufacturer: GENERIC; Manufacturer1 Part Number: 232270671003L; TC: ±100ppm/°C; PressFit: No; Part Number: R0402_10K_1%_0.0625W_100PPM; Component Kind: Standard; Component Type: Standard; Pin Count: 2; Value: 10k; Status: Not Recommended; Power: 0.0625W; Manufacturer Part Number: R0402_10K_1%_0.0625W_100PPM; Case: 0402; Mounted: Yes; Sense: No; Socket: No; SMD: Yes; Manufacturer1 Example: YAGEO PHYCOMP; Manufacturer1 ComponentHeight: 0.4mm; HelpURL: \\cern.ch\dfs\Applications\Altium\Datasheets\R0402_Phycomp_RC0402.pdf; Author: CERN DEM JLC; CreateDate: 03.12.2007; LatestRevisionDate: 17.10.2012
TP5 TP6 = SMD_PAD_1.27X1.27MM: Part Description: 1.27mm x 1.27mm PCB Copper Area (SMD Test Point); Mounted: No; Part Number: SMD_PAD_1.27X1.27MM; Component Type: Standard (No BOM); Pin Count: 1; Family: Test Point; Socket: No; SMD: Yes; Sense: No; Status: None; ComponentHeight: 0mm; HelpURL: Undefined; Author: CERN DEM JLC; CreateDate: 12.01.2008; LatestRevisionDate: 12.01.2008; PackageDescription: 1.27mm x 1.27mm PCB Copper Area (SMD Test Point)
TR1-TR3 = XFMR_MINI-CIRCUITS_TC1-1+: 50 Ohm 1.5 To 500MHz RF Transformers; Part Description: 50 Ohms 1.5 to 500 MHz RF Transformer; Manufacturer Part Number: TC1-1+; Part Number: XFMR_MINI-CIRCUITS_TC1-1+; Component Kind: Standard; Component Type: Standard; Pin Count: 5; Value: 1:1; Status: None; Manufacturer: MINI-CIRCUITS; Mounted: Yes; Socket: No; Sense: No; SMD: Yes; ComponentHeight: 4.06mm; HelpURL: \\cern.ch\dfs\Applications\Altium\Datasheets\XFMR_MINI-CIRCUITS_TC1-1+.pdf; Author: CERN DEM JLC; CreateDate: 08/02/2010; LatestRevisionDate: 27/04/2010

## Sheet GPSDO_Heater.SchDoc: Heater
size 420 x 297 mm; EDA_Number: ARTIQ; Projet: GPSDO; Author: K.Belewicz; CompanyName: WUT ISE; DrawnBy: K.Belewicz; Organization: WUT ISE; Address1: PW ISE; Address2: Nowowiejska 15/19 00-665 Warsaw; Address3: gkasprow@gmail.com; Revision: 1; SheetNumber: -; SheetTotal: -; ModifiedBy: -; CheckedDate: -; DivGrp: WUT ISE; Designer: G.Kasprowicz; ModifiedDate: -; ProjectName: Sensor Box
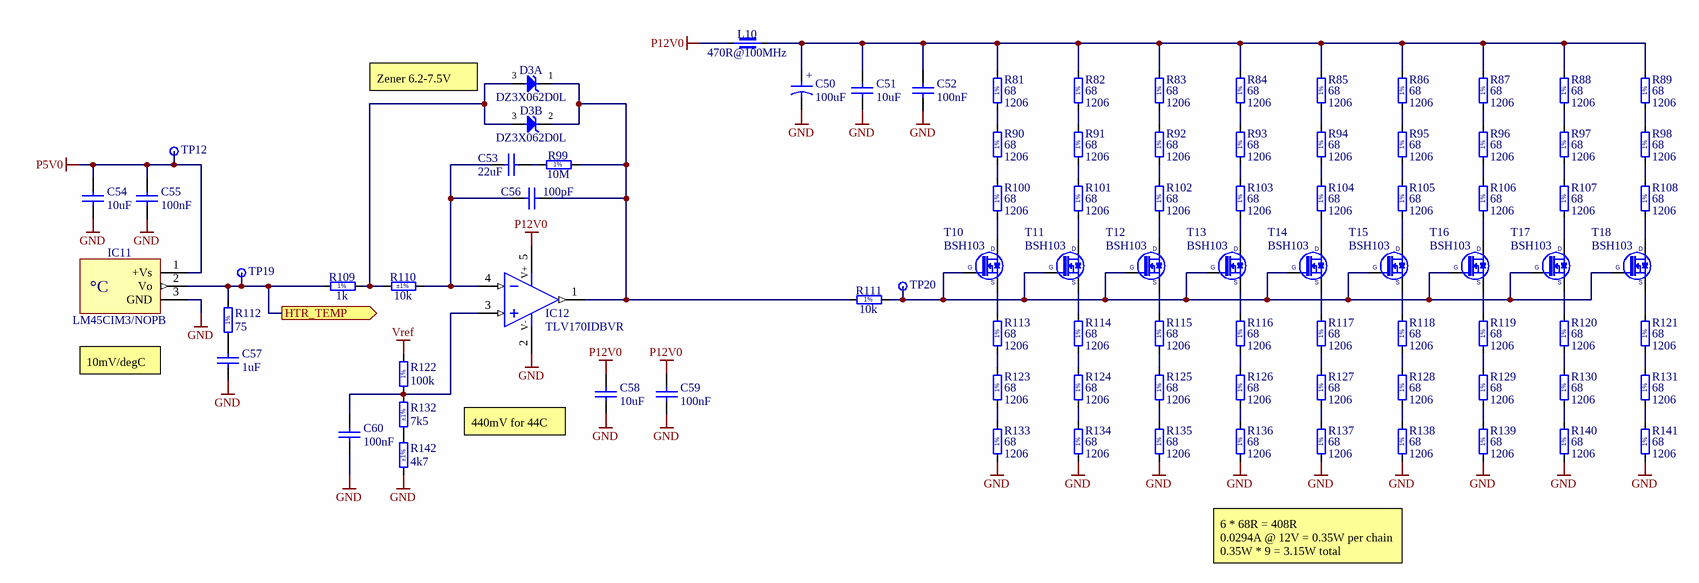
[diagram p1: GPSDO_Heater.SchDoc]

### Parts
C50  100uF  [CAPMP7343X310N]
C51  10uF  [CAPC1608X80N]
C52  100nF  [CAPC1005X55N]
C53  22uF  [CAPC2012X135N]
C54  10uF  [CAPC1608X80N]
C55  100nF  [CAPC1005X55N]
C56  100pF  [CAPC1005X55N]
C57  1uF  [CAPC1005X55N]
C58  10uF  [CAPC1608X80N]
C59  100nF  [CAPC1005X55N]
C60  100nF  [CAPC1005X55N]
D3  DZ3X062D0L  [SOT95P275X140-3N]  (parts A,B of 2)
IC11  LM45CIM3/NOPB  [SOT95P251X112-3N]
IC12  TLV170IDBVR  [SOT95P280X145-5N]
L10  470R@100MHz  [INDC1608X95N]
R81  68  Case: 1206  [RESC3216X65N]
R82  68  Case: 1206  [RESC3216X65N]
R83  68  Case: 1206  [RESC3216X65N]
R84  68  Case: 1206  [RESC3216X65N]
R85  68  Case: 1206  [RESC3216X65N]
R86  68  Case: 1206  [RESC3216X65N]
R87  68  Case: 1206  [RESC3216X65N]
R88  68  Case: 1206  [RESC3216X65N]
R89  68  Case: 1206  [RESC3216X65N]
R90  68  Case: 1206  [RESC3216X65N]
R91  68  Case: 1206  [RESC3216X65N]
R92  68  Case: 1206  [RESC3216X65N]
R93  68  Case: 1206  [RESC3216X65N]
R94  68  Case: 1206  [RESC3216X65N]
R95  68  Case: 1206  [RESC3216X65N]
R96  68  Case: 1206  [RESC3216X65N]
R97  68  Case: 1206  [RESC3216X65N]
R98  68  Case: 1206  [RESC3216X65N]
R99  10M  [RESC2113X55N]
R100  68  Case: 1206  [RESC3216X65N]
R101  68  Case: 1206  [RESC3216X65N]
R102  68  Case: 1206  [RESC3216X65N]
R103  68  Case: 1206  [RESC3216X65N]
R104  68  Case: 1206  [RESC3216X65N]
R105  68  Case: 1206  [RESC3216X65N]
R106  68  Case: 1206  [RESC3216X65N]
R107  68  Case: 1206  [RESC3216X65N]
R108  68  Case: 1206  [RESC3216X65N]
R109  1k  [RESC1005X40N]
R110  10k  Tolerance: ±1%  [RESC1005X40N]
R111  10k  [RESC1005X40N]
R112  75  [RESC1005X40N]
R113  68  Case: 1206  [RESC3216X65N]
R114  68  Case: 1206  [RESC3216X65N]
R115  68  Case: 1206  [RESC3216X65N]
R116  68  Case: 1206  [RESC3216X65N]
R117  68  Case: 1206  [RESC3216X65N]
R118  68  Case: 1206  [RESC3216X65N]
R119  68  Case: 1206  [RESC3216X65N]
R120  68  Case: 1206  [RESC3216X65N]
R121  68  Case: 1206  [RESC3216X65N]
R122  100k  [RESC1005X40N]
R123  68  Case: 1206  [RESC3216X65N]
R124  68  Case: 1206  [RESC3216X65N]
R125  68  Case: 1206  [RESC3216X65N]
R126  68  Case: 1206  [RESC3216X65N]
R127  68  Case: 1206  [RESC3216X65N]
R128  68  Case: 1206  [RESC3216X65N]
R129  68  Case: 1206  [RESC3216X65N]
R130  68  Case: 1206  [RESC3216X65N]
R131  68  Case: 1206  [RESC3216X65N]
R132  7k5  Tolerance: ±1%  [RESC1005X40N]
R133  68  Case: 1206  [RESC3216X65N]
R134  68  Case: 1206  [RESC3216X65N]
R135  68  Case: 1206  [RESC3216X65N]
R136  68  Case: 1206  [RESC3216X65N]
R137  68  Case: 1206  [RESC3216X65N]
R138  68  Case: 1206  [RESC3216X65N]
R139  68  Case: 1206  [RESC3216X65N]
R140  68  Case: 1206  [RESC3216X65N]
R141  68  Case: 1206  [RESC3216X65N]
R142  4k7  Tolerance: ±1%  [RESC1005X40N]
T10  BSH103  [SOT95P230X110-3N]
T11  BSH103  [SOT95P230X110-3N]
T12  BSH103  [SOT95P230X110-3N]
T13  BSH103  [SOT95P230X110-3N]
T14  BSH103  [SOT95P230X110-3N]
T15  BSH103  [SOT95P230X110-3N]
T16  BSH103  [SOT95P230X110-3N]
T17  BSH103  [SOT95P230X110-3N]
T18  BSH103  [SOT95P230X110-3N]
TP12  Test Point  [TPS127]  (value not drawn)  (no BOM)
TP19  Test Point  [TPS127]  (value not drawn)  (no BOM)
TP20  Test Point  [TPS127]  (value not drawn)  (no BOM)

### Ports
HTR_TEMP (out)

### Nets
GND: C50.2 C51.1 C52.1 C54.1 C55.1 C57.1 C58.1 C59.1 C60.1 IC11.3(GND) IC12.2(V-) R133.1 R134.1 R135.1 R136.1 R137.1 R138.1 R139.1 R140.1 R141.1 R142.1
P5V0: C54.2 C55.2 IC11.1(+Vs) TP12.1
P12V0: C58.2 C59.2 IC12.5(V+) L10.1
Vref: R122.2
A1: IC11.2(Vo) R109.1 R112.2 TP19.1 ; port HTR_TEMP
NetC50_1: C50.1 C51.2 C52.2 L10.2 R81.2 R82.2 R83.2 R84.2 R85.2 R86.2 R87.2 R88.2 R89.2
NetC53_1: C53.1 C56.1 IC12.4(IN-) R110.2
NetC53_2: C53.2 R99.1
NetC56_2: C56.2 D3.1(C) D3.2(C) IC12.1(OUT) R99.2 R111.1
NetC57_2: C57.2 R112.1
NetC60_2: C60.2 IC12.3(IN+) R122.1 R132.2
NetD3_3: D3.3(COMA) R109.2 R110.1
NetR81_1: R81.1 R90.2
NetR82_1: R82.1 R91.2
NetR83_1: R83.1 R92.2
NetR84_1: R84.1 R93.2
NetR85_1: R85.1 R94.2
NetR86_1: R86.1 R95.2
NetR87_1: R87.1 R96.2
NetR88_1: R88.1 R97.2
NetR89_1: R89.1 R98.2
NetR90_1: R90.1 R100.2
NetR91_1: R91.1 R101.2
NetR92_1: R92.1 R102.2
NetR93_1: R93.1 R103.2
NetR94_1: R94.1 R104.2
NetR95_1: R95.1 R105.2
NetR96_1: R96.1 R106.2
NetR97_1: R97.1 R107.2
NetR98_1: R98.1 R108.2
NetR100_1: R100.1 T10.3(D)
NetR101_1: R101.1 T11.3(D)
NetR102_1: R102.1 T12.3(D)
NetR103_1: R103.1 T13.3(D)
NetR104_1: R104.1 T14.3(D)
NetR105_1: R105.1 T15.3(D)
NetR106_1: R106.1 T16.3(D)
NetR107_1: R107.1 T17.3(D)
NetR108_1: R108.1 T18.3(D)
NetR111_2: R111.2 T10.1(G) T11.1(G) T12.1(G) T13.1(G) T14.1(G) T15.1(G) T16.1(G) T17.1(G) T18.1(G) TP20.1
NetR113_1: R113.1 R123.2
NetR113_2: R113.2 T10.2(S)
NetR114_1: R114.1 R124.2
NetR114_2: R114.2 T11.2(S)
NetR115_1: R115.1 R125.2
NetR115_2: R115.2 T12.2(S)
NetR116_1: R116.1 R126.2
NetR116_2: R116.2 T13.2(S)
NetR117_1: R117.1 R127.2
NetR117_2: R117.2 T14.2(S)
NetR118_1: R118.1 R128.2
NetR118_2: R118.2 T15.2(S)
NetR119_1: R119.1 R129.2
NetR119_2: R119.2 T16.2(S)
NetR120_1: R120.1 R130.2
NetR120_2: R120.2 T17.2(S)
NetR121_1: R121.1 R131.2
NetR121_2: R121.2 T18.2(S)
NetR123_1: R123.1 R133.2
NetR124_1: R124.1 R134.2
NetR125_1: R125.1 R135.2
NetR126_1: R126.1 R136.2
NetR127_1: R127.1 R137.2
NetR128_1: R128.1 R138.2
NetR129_1: R129.1 R139.2
NetR130_1: R130.1 R140.2
NetR131_1: R131.1 R141.2
NetR132_1: R132.1 R142.2

### Notes on the sheet
- (near D3) Zener 6.2-7.5V
- 10mV/degC
- 440mV for 44C
- 6 * 68R = 408R
  0.0294A @ 12V = 0.35W per chain
  0.35W * 9 = 3.15W total
- Project/Equipment
- Document
- Designer
- Drawn by
- Check.by
- Copyright WUT ISE 2020.
  This documentation describes Open Hardware and is licensed under the CERN OHL v.1.2. You may redistribute and modify this documentation under the terms of the CERN OHL v.1.2. (http://ohwr.org/CERNOHL). This documentation is distributed WITHOUT ANY EXPRESS OR IMPLIED WARRANTY, INCLUDING OF MERCHANTABILITY, SATISFACTORY QUALITY AND FITNESS FOR A PARTICULAR PURPOSE. Please see the CERN OHL v.1.2 for applicable conditions.
- Contact
- File
- Last Mod.
- Print Date
- Sheet
- Size
- A3
- of
- Rev
- (in symbol CTE7343-31_100UF_20V_10%) +
- (in symbol LM45CIM3/NOPB) °C
- (in symbol R0402_1k_1%_0.0625W_100PPM) 1%
- (in symbol R0402_10K_1%_0.0625W_100PPM) 1%
- (in symbol R0402_75R_1%_0.0625W_100PPM) 1%
- (in symbol R0402_100K_1%_0.0625W_100PPM) 1%
- (in symbol R0805_10M_1%_0.125W_100PPM_VISHAY_CRCW e3) 1%
- (in symbol R1206_68R_1%_0.25W_100PPM) 1%

### Library data of the parts
C50 = CTE7343-31_100UF_20V_10%: Polarised capacitor; Part Description: Solid Tantalum Chip Capacitor; Manufacturer: GENERIC; Manufacturer1 Part Number: TAJD107K020R; Voltage: 20V; Tolerance: ±10%; Part Number: CTE7343-31_100UF_20V_10%; Component Kind: Standard; Component Type: Standard; Pin Count: 2; Value: 100uF; Status: Preferred; Manufacturer Part Number: CTE7343-31_100UF_20V_10%; Case: D; Mounted: Yes; Socket: No; SMD: Yes; Sense: No; Manufacturer1 Example: AVX; Manufacturer1 ComponentHeight: 3.1mm; HelpURL: \\cern.ch\dfs\Applications\Altium\Datasheets\CTE_AVX_TAJ.pdf; Author: CERN DEM JLC; CreateDate: 03/12/2007; LatestRevisionDate: 03/12/2007
C51 C54 C58 = CC0603_10UF_10V_10%_X5R: as C22 on sheet GPSDO; Part Number: CC0603_10UF_10V_10%_X5R; Component Kind: Standard; Component Type: Standard; Pin Count: 2; Value: 10uF; Status: None; Manufacturer Part Number: CC0603_10UF_10V_10%_X5R; Case: 0603; Mounted: Yes; Socket: No; SMD: Yes; Sense: No; Manufacturer1 Example: MURATA; Manufacturer1 ComponentHeight: 0.8mm; HelpURL: \\cern.ch\dfs\Applications\Altium\Datasheets\CC0603_MURATA_GRM188R61A106KE69D.pdf; Author: CERN DEM JLC; CreateDate: 31.01.2017; LatestRevisionDate: 31.01.2017
C52 C55 C59 C60 = CC0402_100NF_16V_10%_X5R: as C23 on sheet GPSDO; Part Number: CC0402_100NF_16V_10%_X5R; Component Kind: Standard; Component Type: Standard; Pin Count: 2; Value: 100nF; Status: None; Manufacturer Part Number: CC0402_100NF_16V_10%_X5R; Case: 0402; Mounted: Yes; Socket: No; SMD: Yes; Sense: No; Manufacturer1 Example: MURATA; Manufacturer1 ComponentHeight: 0.55mm; HelpURL: \\cern.ch\dfs\Applications\Altium\Datasheets\CC0402_X5R_MURATA_GRM.pdf; Author: CERN DEM JLC; CreateDate: 10.12.2013; LatestRevisionDate: 10.12.2013
C53 = CC0805_22UF_16V_10%_X5R: Non-polarised capacitor; Manufacturer: GENERIC; Part Description: SMD Multilayer Chip Ceramic Capacitor; Manufacturer1 Part Number: C2012X5R1C226KT; Tolerance: ±10%; Voltage: 16V; TC: X5R; Manufacturer Part Number: CC0805_22UF_16V_10%_X5R; Part Number: CC0805_22UF_16V_10%_X5R; Value: 22uF; Component Kind: Standard; Component Type: Standard; Pin Count: 2; Status: Preferred; Case: 0805; Mounted: Yes; Socket: No; SMD: Yes; Sense: No; Manufacturer1 Example: TDK; Manufacturer1 ComponentHeight: 1.35mm; HelpURL: \\cern.ch\dfs\Applications\Altium\Datasheets\CC0805_X5R_TDK_C.pdf; Author: CERN DEM JLC; CreateDate: 25.10.2012; LatestRevisionDate: 25.10.2012
C56 = CC0402_100PF_50V_5%_C0G: Non-polarised capacitor; Part Description: SMD Multilayer Chip Ceramic Capacitor; Manufacturer: GENERIC; Manufacturer1 Part Number: C0402C101J5GACTU; Voltage: 50V; TC: C0G/NP0; Tolerance: ±5%; Part Number: CC0402_100PF_50V_5%_C0G; Component Kind: Standard; Component Type: Standard; Pin Count: 2; Value: 100pF; Status: Preferred; Manufacturer Part Number: CC0402_100PF_50V_5%_C0G; Case: 0402; Mounted: Yes; Socket: No; SMD: Yes; Sense: No; Manufacturer1 Example: KEMET; Manufacturer1 ComponentHeight: 0.55mm; HelpURL: \\cern.ch\dfs\Applications\Altium\Datasheets\CC0402_C0G_KEMET_(Commercial Grade).pdf; Author: CERN DEM JLC; CreateDate: 03/12/2007; LatestRevisionDate: 22/04/2015
C57 = CC0402_1UF_16V_10%_X5R: as C25 on sheet GPSDO; Part Number: CC0402_1UF_16V_10%_X5R; Component Kind: Standard; Component Type: Standard; Pin Count: 2; Value: 1uF; Status: Preferred; Manufacturer Part Number: CC0402_1UF_16V_10%_X5R; Case: 0402; Mounted: Yes; Socket: No; SMD: Yes; Sense: No; Manufacturer1 Example: TDK; Manufacturer1 ComponentHeight: 0.55mm; HelpURL: \\cern.ch\dfs\Applications\Altium\Datasheets\CC0402_X5R_TDK_C.pdf; Author: CERN DEM JLC; CreateDate: 25.10.2012; LatestRevisionDate: 25.10.2012
D3 = DZ3X062D0L: Dual Common Anode Zener Diode; Part Description: Dual Common Anode Silicon Epitaxial Planar Diode; Manufacturer: PANASONIC; Voltage: 6.2V; Power: 200mA; PressFit: No; Bonding: No; Part Number: DZ3X062D0L; Component Kind: Standard; Component Type: Standard; Device: DZ3X062D0L; PackageDescription: SOT, 0.95mm Pitch; 3 Pin, 1.60mm W X 2.975mm L X 1.40mm H Body, IPC Medium Density; Manufacturer Part Number: DZ3X062D0L; Pin Count: 3; Case: SOT23-3; Mounted: Yes; Socket: No; SMD: Yes; Sense: No; ComponentHeight: 1.40mm; HelpURL: \\cern.ch\dfs\Applications\Altium\Datasheets\DZ3X062D0L.pdf; Author: CERN DEM JLC; CreateDate: 30/09/2014; LatestRevisionDate: 30/09/2014
IC11 = LM45CIM3/NOPB: -20° to +100°C ±3°C Precision Centigrade Temperature Sensors; Manufacturer: TEXAS INSTRUMENTS; PressFit: No; Bonding: No; Part Number: LM45CIM3/NOPB; Component Kind: Standard; Component Type: Standard; Device: LM45CIM3/NOPB; PackageDescription: SOT, 0.95mm Pitch; 3 Pin, 1.30mm W X 2.92mm L X 1.12mm H body, IPC Medium Density; Part Description: -20° to +100°C ±3°C Precision Centigrade Temperature Sensors; Manufacturer Part Number: LM45CIM3/NOPB; Pin Count: 3; Case: SOT23; Mounted: Yes; Socket: No; SMD: Yes; Sense: No; ComponentHeight: 1.12mm; HelpURL: \\cern.ch\dfs\Applications\Altium\Datasheets\LM45CIM3-NOPB.pdf; Author: CERN DEM JLC; CreateDate: 19/01/2011; LatestRevisionDate: 19/01/2011
IC12 = TLV170IDBVR: Low-Power, 36-V Operational Amplifier; Manufacturer: TEXAS INSTRUMENTS; Part Number: TLV170IDBVR; Device: TLV170IDBVR; Component Kind: Standard; Component Type: Standard; PackageDescription: SOT, 0.95mm pitch; 5 pin, 1.60mm W X 2.90mm L X 1.45mm H body, IPC Medium Density; Part Description: Low-Power, 36-V Operational Amplifier; Case: SOT 23-5; Manufacturer Part Number: TLV170IDBVR
L10 = IND0603_MURATA_BLM18PG471SN1D: as L5 on sheet GPSDO; Part Number: IND0603_MURATA_BLM18PG471SN1D; Component Kind: Standard; Component Type: Standard; Pin Count: 2; Value: 470R@100MHz; Manufacturer Part Number: BLM18PG471SN1D; Case: 0603; Mounted: Yes; Socket: No; SMD: Yes; Sense: No; ComponentHeight: 0.95mm; HelpURL: \\cern.ch\dfs\Applications\Altium\Datasheets\IND0603_MURATA_BLM18P.pdf; Author: CERN DEM BC; CreateDate: 17.02.2021; LatestRevisionDate: 17.02.2021
R81-R98 R100-R108 R113-R121 R123-R131 R133-R141 = R1206_68R_1%_0.25W_100PPM: Resistor - 1%; Part Description: General Purpose Thick Film Chip Resistor; Manufacturer: GENERIC; Manufacturer1 Part Number: NRC12F68R0TRF; Power: 0.25W; TC: ±100ppm/°C; PressFit: No; Part Number: R1206_68R_1%_0.25W_100PPM; Component Kind: Standard; Component Type: Standard; Pin Count: 2; Value: 68; Status: Preferred; Tolerance: ±1%; Manufacturer Part Number: R1206_68R_1%_0.25W_100PPM; Mounted: Yes; Sense: No; Socket: No; SMD: Yes; Manufacturer1 Example: NIC COMPONENT; Manufacturer1 ComponentHeight: 0.65mm; HelpURL: \\cern.ch\dfs\Applications\Altium\Datasheets\R1206_NIC_NRC.pdf; Author: CERN DEM JLC; CreateDate: 03/12/2007; LatestRevisionDate: 13/03/2008
R99 = R0805_10M_1%_0.125W_100PPM_VISHAY_CRCW e3: Resistor - 1%; Part Description: 150V, Standard Thick Film Chip Resistor; Manufacturer: VISHAY DALE; Manufacturer Part Number: CRCW080510M0FKEA; Power: 0.125W; TC: ±100ppm/°C; PressFit: No; Part Number: R0805_10M_1%_0.125W_100PPM_VISHAY_CRCW e3; Component Kind: Standard; Component Type: Standard; Pin Count: 2; Value: 10M; Status: None; Tolerance: ±1%; Case: 0805; Mounted: Yes; Sense: No; Socket: No; SMD: Yes; ComponentHeight: 0.5mm; HelpURL: \\cern.ch\dfs\Applications\Altium\Datasheets\R0805_VISHAY_CRCW e3.pdf; Author: CERN DEM BC; CreateDate: 2019-11-12; LatestRevisionDate: 2019-11-12
R109 = R0402_1k_1%_0.0625W_100PPM: Resistor - 1%; Part Description: General Purpose Thick Film Chip Resistor; Manufacturer: GENERIC; Manufacturer1 Part Number: 232270671002L; TC: ±100ppm/°C; PressFit: No; Part Number: R0402_1K_1%_0.0625W_100PPM; Component Kind: Standard; Component Type: Standard; Pin Count: 2; Value: 1k; Status: Not Recommended; Power: 0.0625W; Tolerance: ±1%; Manufacturer Part Number: R0402_1K_1%_0.0625W_100PPM; Case: 0402; Mounted: Yes; Sense: No; Socket: No; SMD: Yes; Manufacturer1 Example: YAGEO PHYCOMP; Manufacturer1 ComponentHeight: 0.4mm; HelpURL: \\cern.ch\dfs\Applications\Altium\Datasheets\R0402_Phycomp_RC0402.pdf; Author: CERN DEM JLC; CreateDate: 03.12.2007; LatestRevisionDate: 17.10.2012; ClassName: Artix
R110 R111 = R0402_10K_1%_0.0625W_100PPM: as R59 on sheet GPSDO; Part Number: R0402_10K_1%_0.0625W_100PPM; Component Kind: Standard; Component Type: Standard; Pin Count: 2; Value: 10k; Status: Not Recommended; Power: 0.0625W; Manufacturer Part Number: R0402_10K_1%_0.0625W_100PPM; Case: 0402; Mounted: Yes; Sense: No; Socket: No; SMD: Yes; Manufacturer1 Example: YAGEO PHYCOMP; Manufacturer1 ComponentHeight: 0.4mm; HelpURL: \\cern.ch\dfs\Applications\Altium\Datasheets\R0402_Phycomp_RC0402.pdf; Author: CERN DEM JLC; CreateDate: 03.12.2007; LatestRevisionDate: 17.10.2012
  R111: Tolerance: ±1%
R112 = R0402_75R_1%_0.0625W_100PPM: as R45 on sheet GPSDO; Part Number: R0402_75R_1%_0.0625W_100PPM; Component Kind: Standard; Component Type: Standard; Pin Count: 2; Value: 75; Status: Not Recommended; Power: 0.0625W; Tolerance: ±1%; Manufacturer Part Number: R0402_75R_1%_0.0625W_100PPM; Case: 0402; Mounted: Yes; Sense: No; Socket: No; SMD: Yes; Manufacturer1 Example: YAGEO PHYCOMP; Manufacturer1 ComponentHeight: 0.4mm; HelpURL: \\cern.ch\dfs\Applications\Altium\Datasheets\R0402_Phycomp_RC0402.pdf; Author: CERN DEM JLC; CreateDate: 03/12/2007; LatestRevisionDate: 17/10/2012
R122 = R0402_100K_1%_0.0625W_100PPM: Resistor - 1%; Part Description: General Purpose Thick Film Chip Resistor; Manufacturer: GENERIC; Manufacturer1 Part Number: 232270671004L; TC: ±100ppm/°C; PressFit: No; Part Number: R0402_100K_1%_0.0625W_100PPM; Component Kind: Standard; Component Type: Standard; Pin Count: 2; Value: 100k; Status: Not Recommended; Power: 0.0625W; Tolerance: ±1%; Manufacturer Part Number: R0402_100K_1%_0.0625W_100PPM; Case: 0402; Mounted: Yes; Sense: No; Socket: No; SMD: Yes; Manufacturer1 Example: YAGEO PHYCOMP; Manufacturer1 ComponentHeight: 0.4mm; HelpURL: \\cern.ch\dfs\Applications\Altium\Datasheets\R0402_Phycomp_RC0402.pdf; Author: CERN DEM JLC; CreateDate: 03/12/2007; LatestRevisionDate: 17/10/2012
R132 = R0402_7K5_1%_0.0625W_100PPM: Resistor - 1%; Part Description: General Purpose Thick Film Chip Resistor; Manufacturer: GENERIC; Manufacturer1 Part Number: 232270677502L; TC: ±100ppm/°C; PressFit: No; Part Number: R0402_7K5_1%_0.0625W_100PPM; Component Kind: Standard; Component Type: Standard; Pin Count: 2; Value: 7k5; Status: Not Recommended; Power: 0.0625W; Manufacturer Part Number: R0402_7K5_1%_0.0625W_100PPM; Case: 0402; Mounted: Yes; Sense: No; Socket: No; SMD: Yes; Manufacturer1 Example: YAGEO PHYCOMP; Manufacturer1 ComponentHeight: 0.4mm; HelpURL: \\cern.ch\dfs\Applications\Altium\Datasheets\R0402_Phycomp_RC0402.pdf; Author: CERN DEM JLC; CreateDate: 03.12.2007; LatestRevisionDate: 17.10.2012
R142 = R0402_4K7_1%_0.0625W_100PPM: as R53 on sheet GPSDO; Part Number: R0402_4K7_1%_0.0625W_100PPM; Component Kind: Standard; Component Type: Standard; Pin Count: 2; Value: 4k7; Status: Not Recommended; Power: 0.0625W; Manufacturer Part Number: R0402_4K7_1%_0.0625W_100PPM; Case: 0402; Mounted: Yes; Sense: No; Socket: No; SMD: Yes; Manufacturer1 Example: YAGEO PHYCOMP; Manufacturer1 ComponentHeight: 0.4mm; HelpURL: \\cern.ch\dfs\Applications\Altium\Datasheets\R0402_Phycomp_RC0402.pdf; Author: CERN DEM JLC; CreateDate: 03.12.2007; LatestRevisionDate: 17.10.2012
T10-T18 = BSH103: N-CHANNEL MOSFET WITH DIODE; Part Description: 30V 850mA N-Channel Enhancement Mode Field-Effect Transistor; Manufacturer: NEXPERIA; PressFit: No; Bonding: No; Part Number: BSH103; Component Kind: Standard; Component Type: Standard; Device: BSH103; PackageDescription: SOT23, 3 pin, Pitch 0.95mm - 1.3mm W X 2.9mm L X 1.1mm H, IPC Medium Density; Manufacturer Part Number: BSH103; Pin Count: 3; Case: SOT23-3; Mounted: Yes; Socket: No; SMD: Yes; Sense: No; ComponentHeight: 1.1mm; HelpURL: \\cern.ch\dfs\Applications\Altium\Datasheets\BSH103.pdf; Author: CERN DEM JLC; CreateDate: 16.03.2010; LatestRevisionDate: 20.06.2017
TP12 TP19 TP20 = SMD_PAD_1.27X1.27MM: as TP5 on sheet GPSDO; Part Number: SMD_PAD_1.27X1.27MM; Component Type: Standard (No BOM); Pin Count: 1; Family: Test Point; Socket: No; SMD: Yes; Sense: No; Status: None; ComponentHeight: 0mm; HelpURL: Undefined; Author: CERN DEM JLC; CreateDate: 12.01.2008; LatestRevisionDate: 12.01.2008; PackageDescription: 1.27mm x 1.27mm PCB Copper Area (SMD Test Point)